# Altium schematic sheet Level Translateor switches.SchDoc
size A3
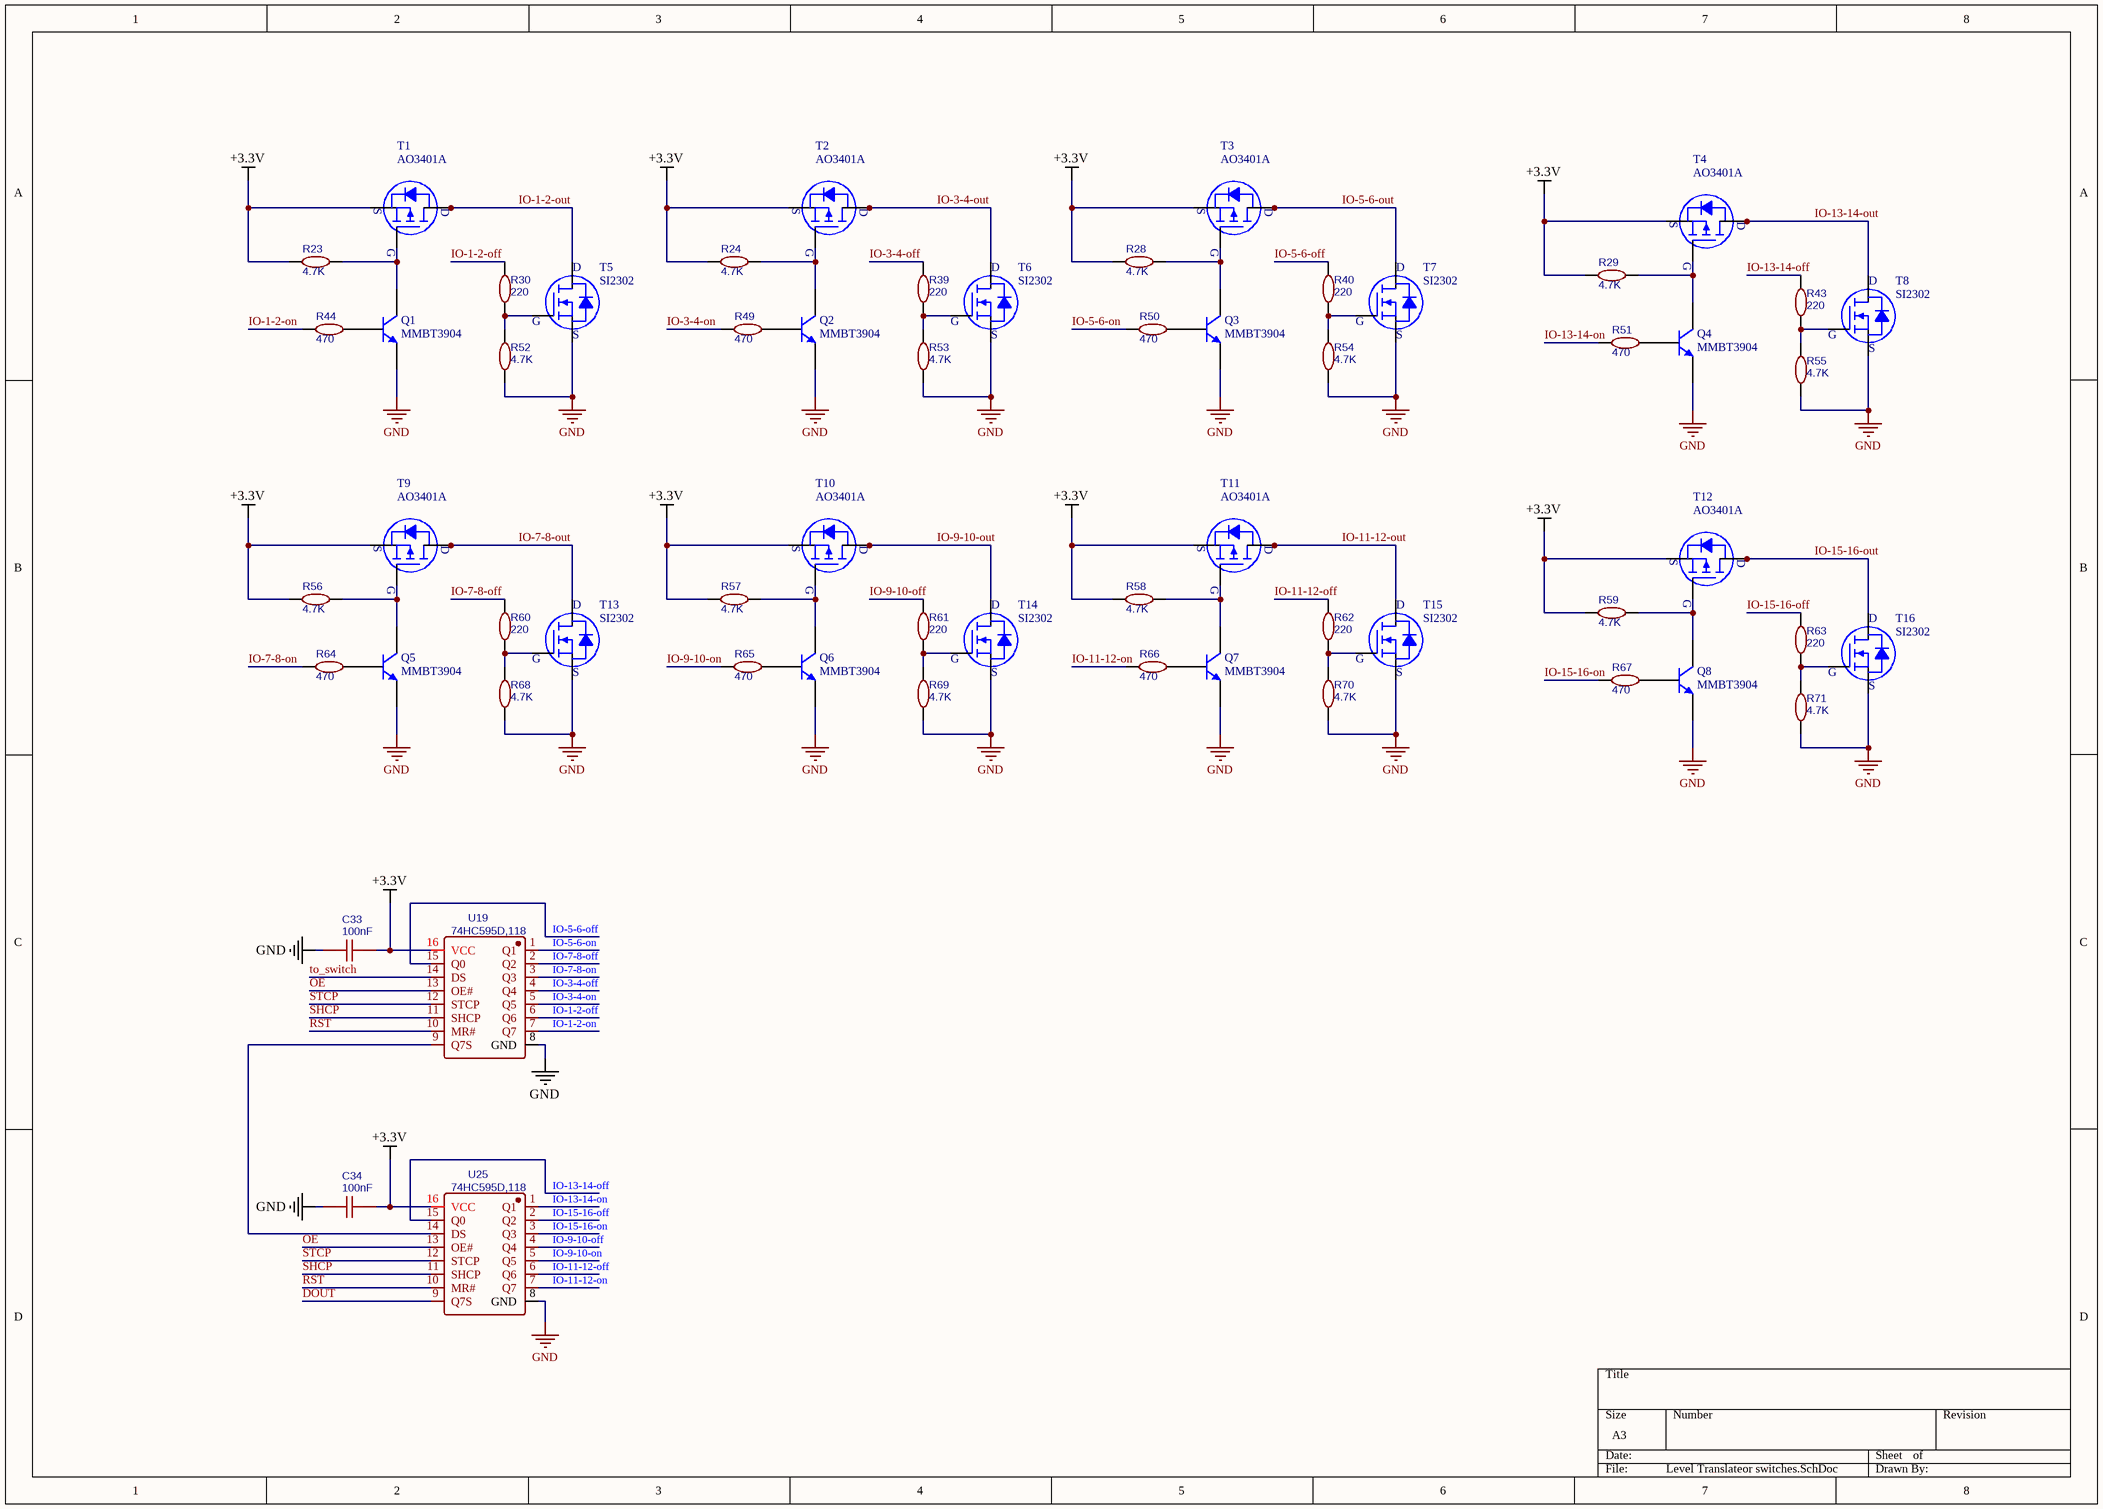
[diagram p0: Level Translateor switches.SchDoc]

## Parts
C33  100nF  [C0603]
C34  100nF  [C0603]
Q1  MMBT3904  [SOT-23-3]
Q2  MMBT3904  [SOT-23-3]
Q3  MMBT3904  [SOT-23-3]
Q4  MMBT3904  [SOT-23-3]
Q5  MMBT3904  [SOT-23-3]
Q6  MMBT3904  [SOT-23-3]
Q7  MMBT3904  [SOT-23-3]
Q8  MMBT3904  [SOT-23-3]
R23  4.7K  [R0603]
R24  4.7K  [R0603]
R28  4.7K  [R0603]
R29  4.7K  [R0603]
R30  220  [R0603]
R39  220  [R0603]
R40  220  [R0603]
R43  220  [R0603]
R44  470  [R0603]
R49  470  [R0603]
R50  470  [R0603]
R51  470  [R0603]
R52  4.7K  [R0603]
R53  4.7K  [R0603]
R54  4.7K  [R0603]
R55  4.7K  [R0603]
R56  4.7K  [R0603]
R57  4.7K  [R0603]
R58  4.7K  [R0603]
R59  4.7K  [R0603]
R60  220  [R0603]
R61  220  [R0603]
R62  220  [R0603]
R63  220  [R0603]
R64  470  [R0603]
R65  470  [R0603]
R66  470  [R0603]
R67  470  [R0603]
R68  4.7K  [R0603]
R69  4.7K  [R0603]
R70  4.7K  [R0603]
R71  4.7K  [R0603]
T1  AO3401A  [SOT-23-3]
T2  AO3401A  [SOT-23-3]
T3  AO3401A  [SOT-23-3]
T4  AO3401A  [SOT-23-3]
T5  SI2302  [SOT-23-3]
T6  SI2302  [SOT-23-3]
T7  SI2302  [SOT-23-3]
T8  SI2302  [SOT-23-3]
T9  AO3401A  [SOT-23-3]
T10  AO3401A  [SOT-23-3]
T11  AO3401A  [SOT-23-3]
T12  AO3401A  [SOT-23-3]
T13  SI2302  [SOT-23-3]
T14  SI2302  [SOT-23-3]
T15  SI2302  [SOT-23-3]
T16  SI2302  [SOT-23-3]
U19  74HC595D,118  [SOIC-16_L9.9-W3.9-P1.27-LS6.0-BL]
U25  74HC595D,118  [SOIC-16_L9.9-W3.9-P1.27-LS6.0-BL]

## Nets
+3.3V: C33.2 C34.2 R23.1 R24.1 R28.1 R29.1 R56.1 R57.1 R58.1 R59.1 T1.3(S) T2.3(S) T3.3(S) T4.3(S) T9.3(S) T10.3(S) T11.3(S) T12.3(S) U19.16(VCC) U25.16(VCC)
GND: C33.1 C34.1 Q1.3(E) Q2.3(E) Q3.3(E) Q4.3(E) Q5.3(E) Q6.3(E) Q7.3(E) Q8.3(E) R52.1 R53.1 R54.1 R55.1 R68.1 R69.1 R70.1 R71.1 T5.3(S) T6.3(S) T7.3(S) T8.3(S) T13.3(S) T14.3(S) T15.3(S) T16.3(S) U19.8(GND) U25.8(GND)
DOUT: U25.9(Q7S)
IO-1-2-off: R30.1 U19.6(Q6)
IO-1-2-on: R44.2 U19.7(Q7)
IO-1-2-out: T1.2(D) T5.2(D)
IO-3-4-off: R39.1 U19.4(Q4)
IO-3-4-on: R49.2 U19.5(Q5)
IO-3-4-out: T2.2(D) T6.2(D)
IO-5-6-off: R40.1 U19.15(Q0)
IO-5-6-on: R50.2 U19.1(Q1)
IO-5-6-out: T3.2(D) T7.2(D)
IO-7-8-off: R60.1 U19.2(Q2)
IO-7-8-on: R64.2 U19.3(Q3)
IO-7-8-out: T9.2(D) T13.2(D)
IO-9-10-off: R61.1 U25.4(Q4)
IO-9-10-on: R65.2 U25.5(Q5)
IO-9-10-out: T10.2(D) T14.2(D)
IO-11-12-off: R62.1 U25.6(Q6)
IO-11-12-on: R66.2 U25.7(Q7)
IO-11-12-out: T11.2(D) T15.2(D)
IO-13-14-off: R43.1 U25.15(Q0)
IO-13-14-on: R51.2 U25.1(Q1)
IO-13-14-out: T4.2(D) T8.2(D)
IO-15-16-off: R63.1 U25.2(Q2)
IO-15-16-on: R67.2 U25.3(Q3)
IO-15-16-out: T12.2(D) T16.2(D)
OE: U19.13(OE#) U25.13(OE#)
RST: U19.10(MR#) U25.10(MR#)
SHCP: U19.11(SHCP) U25.11(SHCP)
STCP: U19.12(STCP) U25.12(STCP)
to_switch: U19.14(DS)
NetQ1_1: Q1.1(B) R44.1
NetQ1_2: Q1.2(C) R23.2 T1.1(G)
NetQ2_1: Q2.1(B) R49.1
NetQ2_2: Q2.2(C) R24.2 T2.1(G)
NetQ3_1: Q3.1(B) R50.1
NetQ3_2: Q3.2(C) R28.2 T3.1(G)
NetQ4_1: Q4.1(B) R51.1
NetQ4_2: Q4.2(C) R29.2 T4.1(G)
NetQ5_1: Q5.1(B) R64.1
NetQ5_2: Q5.2(C) R56.2 T9.1(G)
NetQ6_1: Q6.1(B) R65.1
NetQ6_2: Q6.2(C) R57.2 T10.1(G)
NetQ7_1: Q7.1(B) R66.1
NetQ7_2: Q7.2(C) R58.2 T11.1(G)
NetQ8_1: Q8.1(B) R67.1
NetQ8_2: Q8.2(C) R59.2 T12.1(G)
NetR30_2: R30.2 R52.2 T5.1(G)
NetR39_2: R39.2 R53.2 T6.1(G)
NetR40_2: R40.2 R54.2 T7.1(G)
NetR43_2: R43.2 R55.2 T8.1(G)
NetR60_2: R60.2 R68.2 T13.1(G)
NetR61_2: R61.2 R69.2 T14.1(G)
NetR62_2: R62.2 R70.2 T15.1(G)
NetR63_2: R63.2 R71.2 T16.1(G)
NetU19_9: U19.9(Q7S) U25.14(DS)

## Notes on the sheet
- Title
- Size:
- Date:
- A3
- Number:
- Time:
- Revision:
- Sheet
- of
- File:

## Library data of the parts
C33 C34 = 100nF: Manufacturer: YAGEO; Manufacture Part Number: CC0603KRX7R9BB104; nameAlias: Capacitance; SMT Type: Basic; BOM_LCSC Assembly: Yes; spicePre: C; spiceSymbolName: CC0603KRX7R9BB104; Supplier: LCSC; Supplier Part Number: C14663
Q1-Q8 = MMBT3904: MMBT Series 40 V 200 mA SMT NPN Silicon General Purpose Transistor - SOT-23; Manufacturer: Changjiang Electronics Tech (CJ); LCSC Part Number: C20526; Supplier: LCSC; Manufacture Part Number: MMBT3904
R23 R24 R28 R29 R52-R59 R68-R71 = 1K: Manufacture Part Number: 0603WAF4701T5E; Manufacturer: Uniroyal Elec; nameAlias: Resistance (Ohms); Supplier: LCSC; Supplier Part Number: C23162; spicePre: R
R30 R39 R40 R43 R60-R63 = 1K: Manufacture Part Number: 0603WAF2200T5E; Manufacturer: Uniroyal Elec; nameAlias: Resistance (Ohms); Supplier: LCSC; Supplier Part Number: C22962; spicePre: R
R44 R49-R51 R64-R67 = 1K: Manufacture Part Number: 0603WAF4700T5E; Manufacturer: Uniroyal Elec; nameAlias: Resistance (Ohms); Supplier: LCSC; Supplier Part Number: C23179; spicePre: R
T1-T4 T9-T12 = AO3401A: Manufacturer: Alpha & Omega Semicon; LCSC Part Number: C15127; Manufacture Part Number: AO3401A
T5-T8 T13-T16 = SI2302: MOSFET N TRENCH 20V 2.1A 1.2V @ 50UA 72 M? @ 3.6A,4.5V SOT-23(SOT-23-3) ROHS; Manufacturer: Guangdong Hottech; LCSC Part Number: C181087; Manufacture Part Number: SI2302
U19 U25 = 74HC595D,118: Manufacturer: Nexperia; SMT Type: Basic; spicePre: X; BOM_LCSC Assembly: Yes; image: //image.lceda.cn/szlcsc/C5947.jpg; spiceSymbolName: 74HC595D,118; Supplier: LCSC; Manufacture Part Number: 74HC595D,118; Supplier Part Number: C5947